# EasyEDA schematic z80hb3_2021-04-01.json
TITLE: Main Board; REV: 1.3; Date: 2019-09-21; Sheet: 1/1; Drawn By: amirgeva; Company: MLGSoft
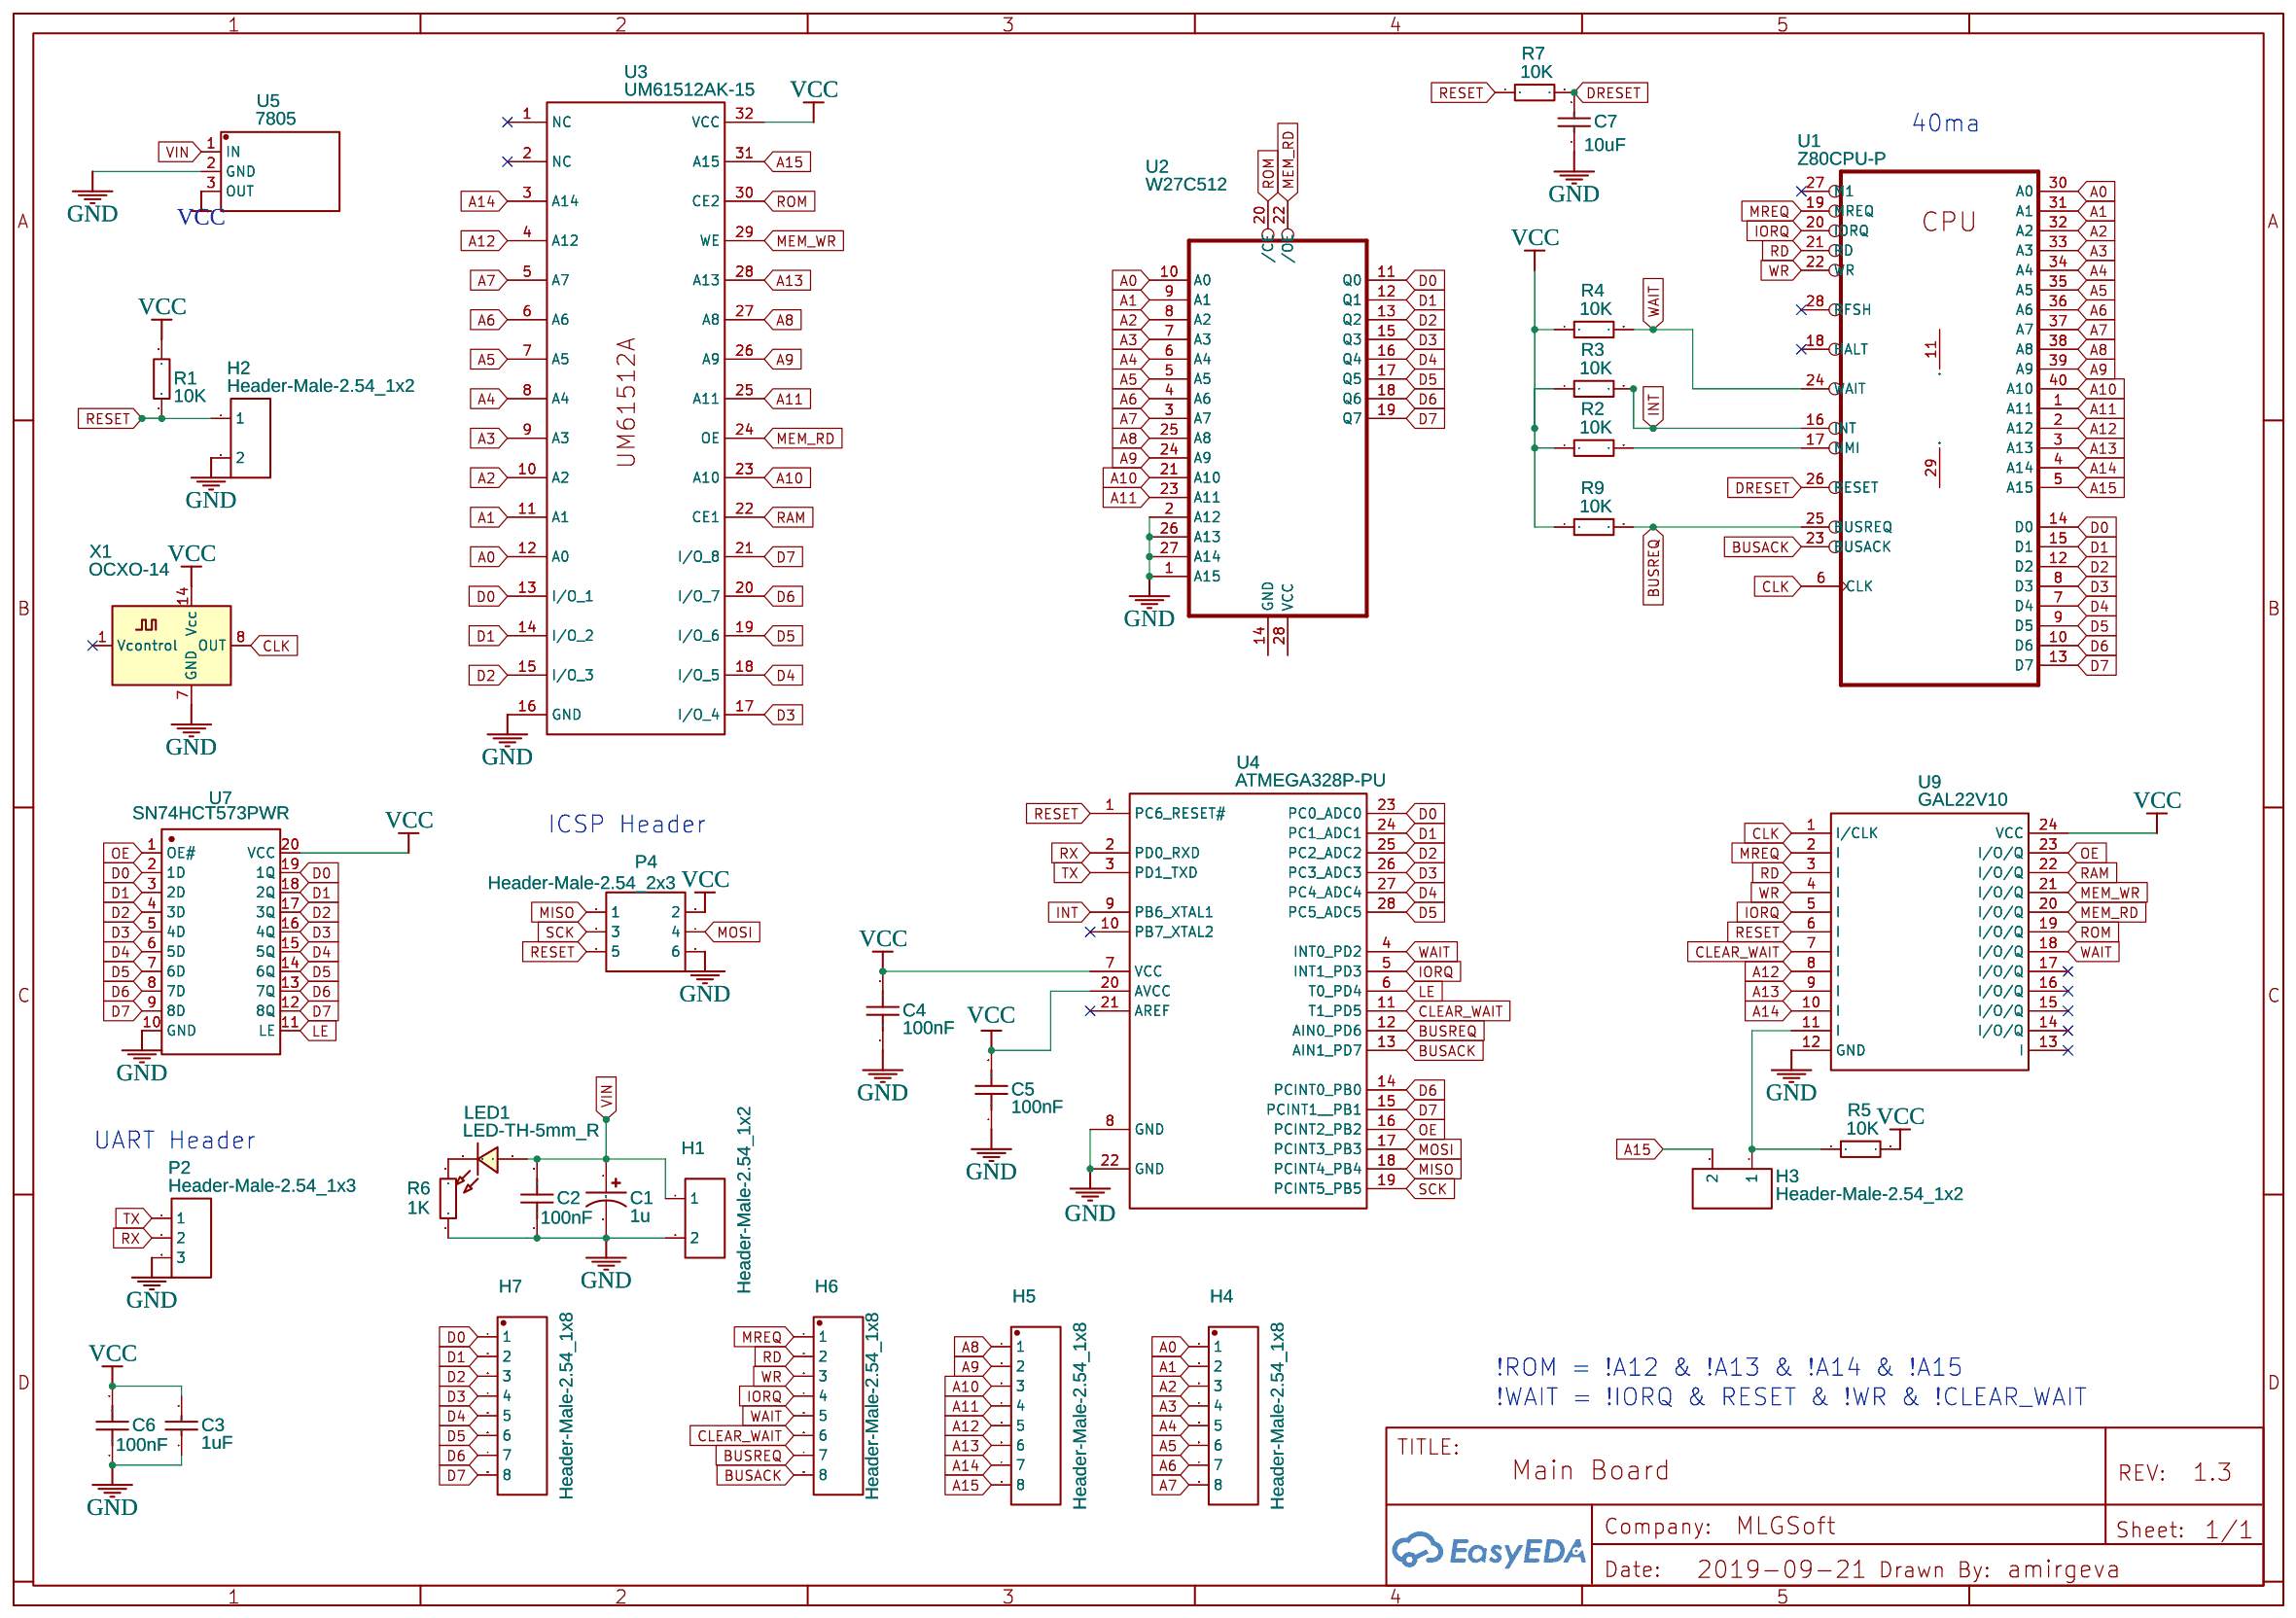
[diagram p0: schematic sheet]

## Parts
C1  1u  [CAP-D3.0×F1.5]
C2  100nF  [C0402]
C3  1uF  [C0402]
C4  100nF  [C0402]
C5  100nF  [C0402]
C6  100nF  [C0402]
C7  10uF  [C0402]
H1  Header-Male-2.54_1x2  [HDR-2X1/2.54]
H2  Header-Male-2.54_1x2  [HDR-2X1/2.54]
H3  Header-Male-2.54_1x2  [HDR-2X1/2.54]
H4  Header-Male-2.54_1x8  [HDR-TH_8P-P2.54-V-M]
H5  Header-Male-2.54_1x8  [HDR-TH_8P-P2.54-V-M]
H6  Header-Male-2.54_1x8  [HDR-TH_8P-P2.54-V-M]
H7  Header-Male-2.54_1x8  [HDR-TH_8P-P2.54-V-M]
LED1  LED-TH-5mm_R  [LED-TH_BD5.0_RED]
P2  Header-Male-2.54_1x3  [HDR-3X1/2.54]
P4  Header-Male-2.54_2x3  [HDR-3X2/2.54]
R1  10K  [R0402]
R2  10K  [R0402]
R3  10K  [R0402]
R4  10K  [R0402]
R5  10K  [R0402]
R6  1K  [R0402]
R7  10K  [R0402]
R9  10K  [R0402]
U1  Z80CPU-P  [DIP-40]
U2  W27C512  [W27C512]
U3  UM61512AK-15  [DIP-32_300MIL]
U4  ATMEGA328P-PU  [DIP-28_L34.6-W7.3-P2.54-LS10.2-BL]
U5  7805  [TO-220-3_L10.0-W4.5-P2.54-L]
U7  SN74HCT573PWR  [TSSOP-20_L6.5-W4.4-P0.65-LS6.4-BL]
U9  GAL22V10  [DIP24]
X1  OCXO-14  [OSCILLATOR_DIP-14]

## Library data of the parts
C1 = CE_TH_D3.0×F1.5_US: Contributor: LCEDA_Lib
C2 C4-C6 = 0402B104K160: Supplier: LCSC; Manufacturer: WTC; Supplier Part: C83056
C3 = CL05A105KO5NNNC: Supplier: LCSC; Manufacturer: SAMSUNG; Supplier Part: C29266; LCSC Assembly: Yes; SMT Type: Extend
C7 = CL05A106MQ5NUNC: Supplier: LCSC; Manufacturer: SAMSUNG; Supplier Part: C15525; SMT Type: Basic; JLCPCB SMD: Yes; LCSC Assembly: Yes
H1-H3 = -: Supplier: LCSC; Manufacturer: TE Connectivity; Manufacturer Part: 826629-2; image: //image.lceda.cn/szlcsc/C86471.jpg; Supplier Part: C86471
H4-H7 = Header-Male-2.54_1x8: Supplier: LCSC; Manufacturer: Ckmtw; Manufacturer Part: 210S-1*8P L=11.6MMGold-plated black; Contributor: LCSC; Supplier Part: C124381; LCSC Assembly: Yes; SMT Type: Extend
LED1 = LED-TH-5mm_R: Manufacturer: EVERLIGHT(台湾亿光); Manufacturer Part: 333-2SURD/S530-A3; Supplier Part: C87271; Supplier: LCSC; Contributor: LCEDA_Lib
P2 = -: Supplier: LCSC; Manufacturer: BOOMELE; Manufacturer Part: Header2.54mm 1*3P; image: //image.lceda.cn/szlcsc/C49257.jpg; Supplier Part: C49257
P4 = -: Supplier: LCSC; Manufacturer: BOOMELE; Supplier Part: C65114
R1-R5 R7 R9 = 0402WGF1002TCE: Supplier: LCSC; Manufacturer: UniOhm; Supplier Part: C25744; SMT Type: Basic; JLCPCB SMD: Yes; LCSC Assembly: Yes
R6 = RC0402JR-071KL: Supplier: LCSC; Manufacturer: YAGEO; Supplier Part: C105637
U1 = -: Manufacturer Part: ?
U2 = -: Contributor: jmclabexperience
U3 = -: link: http://www.lupinek.com/soubory/um61512.pdf; Contributor: Guest
U4 = ATMEGA328P-PU: sourceId: Oic6oiASL; Supplier: LCSC; Manufacturer: MICROCHIP; image: //image.lceda.cn/szlcsc/C33901.jpg; Contributor: LCSC; Supplier Part: C33901
U5 = 7805: Supplier: LCSC; Supplier Part: C305416; Manufacturer: Foshan Blue Rocket Elec; Contributor: LCSC; LCSC Assembly: Yes; SMT Type: Extend
U7 = SN74HCT573PWR: Supplier: LCSC; Manufacturer: TI; Contributor: LCSC; Supplier Part: C141336; SMT Type: Extend; JLCPCB SMD: Yes; LCSC Assembly: Yes
U9 = GAL22V10: Contributor: wawa1474
X1 = -: Contributor: KiCAD; license: https://www.gnu.org/licenses/lgpl-2.1.html; Manufacturer Part: ?

## Nets
GND: C1.2 C2.1 C3.1 C4.1 C5.1 C6.1 C7.1 H1.2 H2.2 P2.3 P4.6 R6.1 U2.1(A15) U2.2(A12) U2.26(A13) U2.27(A14) U3.16(GND) U4.8(GND) U4.22(GND) U5.2(GND) U7.10(GND) U9.12(GND) X1.7(GND)
VCC: C3.2 C4.2 C5.2 C6.2 P4.2 R1.2 R2.1 R3.1 R4.1 R5.2 R9.1 U3.32(VCC) U4.7(VCC) U4.20(AVCC) U5.3(OUT) U7.20(VCC) U9.24(VCC) X1.14(Vcc)
VIN: C1.1 C2.2 H1.1 LED1.1 U5.1(IN)
A0: H4.1 U1.30(A0) U2.10(A0) U3.12(A0)
A1: H4.2 U1.31(A1) U2.9(A1) U3.11(A1)
A2: H4.3 U1.32(A2) U2.8(A2) U3.10(A2)
A3: H4.4 U1.33(A3) U2.7(A3) U3.9(A3)
A4: H4.5 U1.34(A4) U2.6(A4) U3.8(A4)
A5: H4.6 U1.35(A5) U2.5(A5) U3.7(A5)
A6: H4.7 U1.36(A6) U2.4(A6) U3.6(A6)
A7: H4.8 U1.37(A7) U2.3(A7) U3.5(A7)
A8: H5.1 U1.38(A8) U2.25(A8) U3.27(A8)
A9: H5.2 U1.39(A9) U2.24(A9) U3.26(A9)
A10: H5.3 U1.40(A10) U2.21(A10) U3.23(A10)
A11: H5.4 U1.1(A11) U2.23(A11) U3.25(A11)
A12: H5.5 U1.2(A12) U3.4(A12) U9.8(I)
A13: H5.6 U1.3(A13) U3.28(A13) U9.9(I)
A14: H5.7 U1.4(A14) U3.3(A14) U9.10(I)
A15: H3.2 H5.8 U1.5(A15) U3.31(A15)
BUSACK: H6.8 U1.23(BUSACK) U4.13(AIN1 PD7)
BUSREQ: H6.7 R9.2 U1.25(BUSREQ) U4.12(AIN0 PD6)
CLEAR_WAIT: H6.6 U4.11(T1 PD5) U9.7(I)
CLK: U1.6(CLK) U9.1(I/CLK) X1.8(OUT)
D0: H7.1 U1.14(D0) U2.11(Q0) U3.13(I/O 1) U4.23(PC0 ADC0) U7.2(1D) U7.19(1Q)
D1: H7.2 U1.15(D1) U2.12(Q1) U3.14(I/O 2) U4.24(PC1 ADC1) U7.3(2D) U7.18(2Q)
D2: H7.3 U1.12(D2) U2.13(Q2) U3.15(I/O 3) U4.25(PC2 ADC2) U7.4(3D) U7.17(3Q)
D3: H7.4 U1.8(D3) U2.15(Q3) U3.17(I/O 4) U4.26(PC3 ADC3) U7.5(4D) U7.16(4Q)
D4: H7.5 U1.7(D4) U2.16(Q4) U3.18(I/O 5) U4.27(PC4 ADC4) U7.6(5D) U7.15(5Q)
D5: H7.6 U1.9(D5) U2.17(Q5) U3.19(I/O 6) U4.28(PC5 ADC5) U7.7(6D) U7.14(6Q)
D6: H7.7 U1.10(D6) U2.18(Q6) U3.20(I/O 7) U4.14(PCINT0 PB0) U7.8(7D) U7.13(7Q)
D7: H7.8 U1.13(D7) U2.19(Q7) U3.21(I/O 8) U4.15(PCINT1  PB1) U7.9(8D) U7.12(8Q)
DRESET: C7.2 R7.2 U1.26(RESET)
INT: R3.2 U1.16(INT) U4.9(PB6 XTAL1)
IORQ: H6.4 U1.20(IORQ) U4.5(INT1 PD3) U9.5(I)
LE: U4.6(T0 PD4) U7.11(LE)
MEM_RD: U2.22(/OE) U3.24(OE) U9.20(I/O/Q)
MEM_WR: U3.29(WE) U9.21(I/O/Q)
MISO: P4.1 U4.18(PCINT4 PB4)
MOSI: P4.4 U4.17(PCINT3 PB3)
MREQ: H6.1 U1.19(MREQ) U9.2(I)
OE: U4.16(PCINT2 PB2) U7.1(OE#) U9.23(I/O/Q)
RAM: U3.22(CE1) U9.22(I/O/Q)
RD: H6.2 U1.21(RD) U9.3(I)
RESET: H2.1 P4.5 R1.1 R7.1 U4.1(PC6 RESET#) U9.6(I)
ROM: U2.20(/CE) U3.30(CE2) U9.19(I/O/Q)
RX: P2.2 U4.2(PD0 RXD)
SCK: P4.3 U4.19(PCINT5 PB5)
TX: P2.1 U4.3(PD1 TXD)
WAIT: H6.5 R4.2 U1.24(WAIT) U4.4(INT0 PD2) U9.18(I/O/Q)
WR: H6.3 U1.22(WR) U9.4(I)
Net-(H3-1): H3.1 R5.1 U9.11(I)
Net-(LED1-2): LED1.2 R6.2
Net-(R2-2): R2.2 U1.17(NMI)

Not connected (* = marked no-connect by the designer): U1 11(VCC) 18(HALT)* 27(M1)* 28(RFSH)* 29(GND); U2 14(GND) 28(VCC); U3 1(NC)* 2(NC)*; U4 10(PB7 XTAL2)* 21(AREF)*; U9 13(I)* 14(I/O/Q)* 15(I/O/Q)* 16(I/O/Q)* 17(I/O/Q)*; X1 1(Vcontrol)*

## Notes on the sheet
- 40ma
- ICSP Header
- UART Header
- !ROM = !A12 & !A13 & !A14 & !A15
- !WAIT = !IORQ & RESET & !WR & !CLEAR_WAIT
